# Altium schematic sheet CAN_HUB.SchDoc
size A
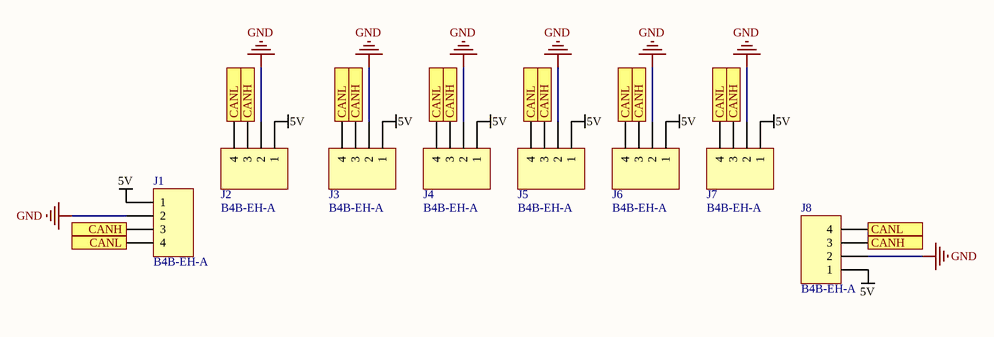
[diagram p0: CAN_HUB.SchDoc]

## Parts
J1  B4B-EH-A  [MHDR1X4]
J2  B4B-EH-A  [MHDR1X4]
J3  B4B-EH-A  [MHDR1X4]
J4  B4B-EH-A  [MHDR1X4]
J5  B4B-EH-A  [MHDR1X4]
J6  B4B-EH-A  [MHDR1X4]
J7  B4B-EH-A  [MHDR1X4]
J8  B4B-EH-A  [MHDR1X4]

## Ports
CANH, CANL

## Nets
5V: J1.1 J2.1 J3.1 J4.1 J5.1 J6.1 J7.1 J8.1
GND: J1.2 J2.2 J3.2 J4.2 J5.2 J6.2 J7.2 J8.2
CANH: J1.3 J2.3 J3.3 J4.3 J5.3 J6.3 J7.3 J8.3 ; port CANH
CANL: J1.4 J2.4 J3.4 J4.4 J5.4 J6.4 J7.4 J8.4 ; port CANL

## Library data of the parts
J1-J8 = MHDR1X4: Header, 4-Pin; LatestRevisionDate: 17-Jul-2002; LatestRevisionNote: Re-released for DXP Platform.; Publisher: Altium Limited